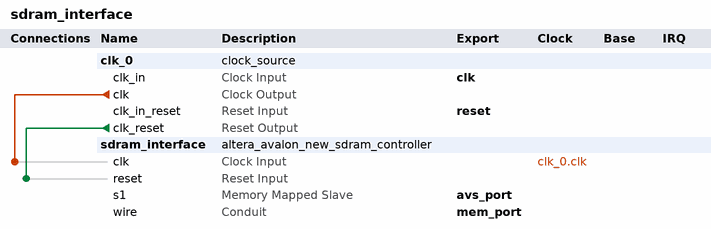
[diagram p0: system contents]
# Platform Designer (Qsys) system sdram_interface, Cyclone IV E EP4CE6F17C8
# Parameters at their usual value, and those the tool derives, are not listed.
package require -exact qsys 18.1
create_system sdram_interface
set_project_property DEVICE_FAMILY {Cyclone IV E}
set_project_property DEVICE EP4CE6F17C8

add_instance clk_0 clock_source 18.1
set_instance_parameter_value clk_0 clockFrequency 100000000
set_instance_parameter_value clk_0 resetSynchronousEdges DEASSERT

add_instance sdram_interface altera_avalon_new_sdram_controller 18.1
set_instance_parameter_value sdram_interface TAC 5.5
set_instance_parameter_value sdram_interface TRCD 20.0
set_instance_parameter_value sdram_interface TRP 20.0
set_instance_parameter_value sdram_interface TWR 20.0
set_instance_parameter_value sdram_interface casLatency 3
set_instance_parameter_value sdram_interface columnWidth 9
set_instance_parameter_value sdram_interface dataWidth 16
set_instance_parameter_value sdram_interface generateSimulationModel false
set_instance_parameter_value sdram_interface model single_Micron_MT48LC4M32B2_7_chip
set_instance_parameter_value sdram_interface numberOfBanks 4
set_instance_parameter_value sdram_interface numberOfChipSelects 1
set_instance_parameter_value sdram_interface powerUpDelay 200.0
set_instance_parameter_value sdram_interface refreshPeriod 7.8125
set_instance_parameter_value sdram_interface rowWidth 13

# connections
add_connection clk_0.clk sdram_interface.clk clock
add_connection clk_0.clk_reset sdram_interface.reset reset

# exported interfaces
add_interface avs_port avalon slave
set_interface_property avs_port EXPORT_OF sdram_interface.s1
add_interface clk clock sink
set_interface_property clk EXPORT_OF clk_0.clk_in
add_interface mem_port conduit end
set_interface_property mem_port EXPORT_OF sdram_interface.wire
add_interface reset reset sink
set_interface_property reset EXPORT_OF clk_0.clk_in_reset

set_interconnect_requirement {$system} qsys_mm.clockCrossingAdapter HANDSHAKE
set_interconnect_requirement {$system} qsys_mm.enableEccProtection FALSE
set_interconnect_requirement {$system} qsys_mm.insertDefaultSlave FALSE
set_interconnect_requirement {$system} qsys_mm.maxAdditionalLatency 1

save_system sdram_interface.qsys
